# Altium schematic sheet BANK14.SchDoc: XC7A3G - BANK14
size A4; Date: 9 AUG 2026; Engineer: Parsa Malekpour; Revision: 1.0.0; SheetNumber: 2; SheetTotal: 18
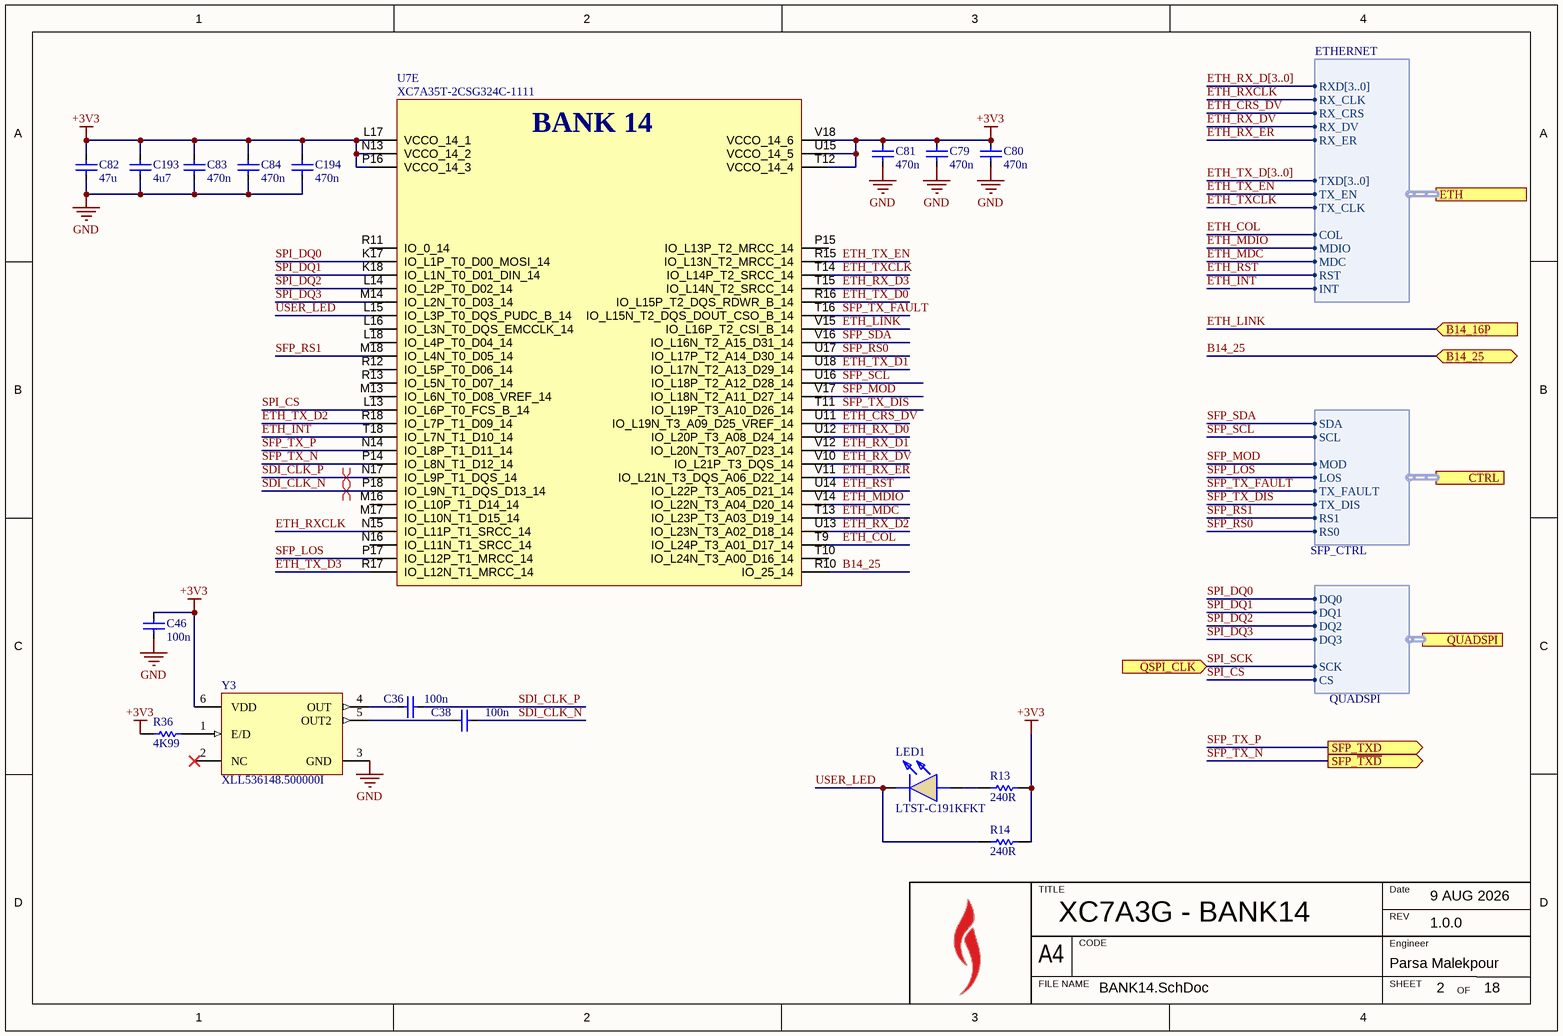
[diagram p0: BANK14.SchDoc]

## Parts
C36  value 100n  [FP-C1005-050-0_05-IPC_C]  (hidden comment: C1005X7R1H104K050BB)
C38  value 100n  [FP-C1005-050-0_05-IPC_C]  (hidden comment: C1005X7R1H104K050BB)
C46  value 100n  [FP-C1005-050-0_05-IPC_C]  (hidden comment: C1005X7R1H104K050BB)
C79  value 470n  [FP-C1005-050-0_05-IPC_C]  (hidden comment: C1005X5R1E474K050BB)
C80  value 470n  [FP-C1005-050-0_05-IPC_C]  (hidden comment: C1005X5R1E474K050BB)
C81  value 470n  [FP-C1005-050-0_05-IPC_C]  (hidden comment: C1005X5R1E474K050BB)
C82  value 47u  [FP-C2012-125-0_2-IPC_C]  (hidden comment: C2012X5R1A476M125AC)
C83  value 470n  [FP-C1005-050-0_05-IPC_C]  (hidden comment: C1005X5R1E474K050BB)
C84  value 470n  [FP-C1005-050-0_05-IPC_C]  (hidden comment: C1005X5R1E474K050BB)
C193  value 4u7  [FP-C1005-050-0_20-0_10-IPC_C]  (hidden comment: C1005X5R1A475K050BE)
C194  value 470n  [FP-C1005-050-0_05-IPC_C]  (hidden comment: C1005X5R1E474K050BB)
LED1  LTST-C191KFKT  [LEDC1608X55N]
R13  value 240R  [RESC1005X40X25LL05T10]  (hidden comment: RC0402FR-07240RL)
R14  value 240R  [RESC1005X40X25LL05T10]  (hidden comment: RC0402FR-07240RL)
R36  value 4K99  [RESC1005X40X25LL05T10]  (hidden comment: RC0402FR-074K99L)
U7  XC7A35T-2CSG324C-1111  [BGA324C80P18X18_1500X1500X150]  (part E of 8)
Y3  XLL536148.500000I  [JS6_MFG]

## Ports
B14_16P (in, see TOP[1B]), B14_25 (bidir, see TOP[1B]), CTRL (harness SFP_CTRL, see TOP[2B], OPTICS[1B]), ETH (harness ETHERNET, see TOP[1C]), QSPI_CLK (in, see TOP[2C]), QUADSPI (harness QUADSPI, see TOP[1C], FLASH[3B]), SFP_TXD (out, see TOP[2B]), SFP_~{TXD} (out, see TOP[2B])

## Harnesses
ETHERNET: RXD[3..0], TXD[3..0], TX_EN, TX_CLK, RX_CLK, RX_CRS, RX_DV, COL, RX_ER, MDIO, MDC, RST, INT
QUADSPI: DQ0, DQ1, DQ2, DQ3, SCK, CS
SFP_CTRL: RS0, RS1, TX_DIS, TX_FAULT, LOS, MOD, SCL, SDA

## Nets
+3V3: C46.2 C79.1 C80.1 C81.1 C82.1 C83.1 C84.1 C193.1 C194.1 R13.2 R14.2 R36.1 U7.L17(VCCO_14_1) U7.N13(VCCO_14_2) U7.P16(VCCO_14_3) U7.T12(VCCO_14_4) U7.U15(VCCO_14_5) U7.V18(VCCO_14_6) Y3.6(VDD)
GND: C46.1 C79.2 C80.2 C81.2 C82.2 C83.2 C84.2 C193.2 C194.2 Y3.3(GND)
B14_25: U7.R10(IO_25_14) ; port B14_25
ETH_COL: U7.T9(IO_L24P_T3_A01_D17_14) ; port ETH.COL
ETH_CRS_DV: U7.U11(IO_L19N_T3_A09_D25_VREF_14) ; port ETH.RX_CRS
ETH_INT: U7.T18(IO_L7N_T1_D10_14) ; port ETH.INT
ETH_LINK: U7.V15(IO_L16P_T2_CSI_B_14) ; port B14_16P
ETH_MDC: U7.T13(IO_L23P_T3_A03_D19_14) ; port ETH.MDC
ETH_MDIO: U7.V14(IO_L22N_T3_A04_D20_14) ; port ETH.MDIO
ETH_RST: U7.U14(IO_L22P_T3_A05_D21_14) ; port ETH.RST
ETH_RX_D0: U7.U12(IO_L20P_T3_A08_D24_14)
ETH_RX_D1: U7.V12(IO_L20N_T3_A07_D23_14)
ETH_RX_D2: U7.U13(IO_L23N_T3_A02_D18_14)
ETH_RX_D3: U7.T15(IO_L14N_T2_SRCC_14)
ETH_RX_DV: U7.V10(IO_L21P_T3_DQS_14) ; port ETH.RX_DV
ETH_RX_ER: U7.V11(IO_L21N_T3_DQS_A06_D22_14) ; port ETH.RX_ER
ETH_RXCLK: U7.N15(IO_L11P_T1_SRCC_14) ; port ETH.RX_CLK
ETH_TX_D0: U7.R16(IO_L15P_T2_DQS_RDWR_B_14)
ETH_TX_D1: U7.U18(IO_L17N_T2_A13_D29_14)
ETH_TX_D2: U7.R18(IO_L7P_T1_D09_14)
ETH_TX_D3: U7.R17(IO_L12N_T1_MRCC_14)
ETH_TX_EN: U7.R15(IO_L13N_T2_MRCC_14) ; port ETH.TX_EN
ETH_TXCLK: U7.T14(IO_L14P_T2_SRCC_14) ; port ETH.TX_CLK
SDI_CLK_N: C38.2 U7.P18(IO_L9N_T1_DQS_D13_14)
SDI_CLK_P: C36.2 U7.N17(IO_L9P_T1_DQS_14)
SFP_LOS: U7.P17(IO_L12P_T1_MRCC_14) ; port CTRL.LOS
SFP_MOD: U7.V17(IO_L18N_T2_A11_D27_14) ; port CTRL.MOD
SFP_RS0: U7.U17(IO_L17P_T2_A14_D30_14) ; port CTRL.RS0
SFP_RS1: U7.M18(IO_L4N_T0_D05_14) ; port CTRL.RS1
SFP_SCL: U7.U16(IO_L18P_T2_A12_D28_14) ; port CTRL.SCL
SFP_SDA: U7.V16(IO_L16N_T2_A15_D31_14) ; port CTRL.SDA
SFP_TX_DIS: U7.T11(IO_L19P_T3_A10_D26_14) ; port CTRL.TX_DIS
SFP_TX_FAULT: U7.T16(IO_L15N_T2_DQS_DOUT_CSO_B_14) ; port CTRL.TX_FAULT
SFP_TX_N: U7.P14(IO_L8N_T1_D12_14) ; port SFP_~{TXD}
SFP_TX_P: U7.N14(IO_L8P_T1_D11_14) ; port SFP_TXD
SPI_CS: U7.L13(IO_L6P_T0_FCS_B_14) ; port QUADSPI.CS
SPI_DQ0: U7.K17(IO_L1P_T0_D00_MOSI_14) ; port QUADSPI.DQ0
SPI_DQ1: U7.K18(IO_L1N_T0_D01_DIN_14) ; port QUADSPI.DQ1
SPI_DQ2: U7.L14(IO_L2P_T0_D02_14) ; port QUADSPI.DQ2
SPI_DQ3: U7.M14(IO_L2N_T0_D03_14) ; port QUADSPI.DQ3
SPI_SCK: port QSPI_CLK, port QUADSPI.SCK
USER_LED: LED1.1(K) R14.1 U7.L15(IO_L3P_T0_DQS_PUDC_B_14)
NetC36_1: C36.1 Y3.4(OUT)
NetC38_1: C38.1 Y3.5(OUT2)
NetLED1_2: LED1.2(A) R13.1
NetR36_2: R36.2 Y3.1(E/D)

Not connected (* = marked no-connect by the designer): U7 L16(IO_L3N_T0_DQS_EMCCLK_14) L18(IO_L4P_T0_D04_14) M13(IO_L6N_T0_D08_VREF_14) M16(IO_L10P_T1_D14_14) M17(IO_L10N_T1_D15_14) N16(IO_L11N_T1_SRCC_14) P15(IO_L13P_T2_MRCC_14) R11(IO_0_14) R12(IO_L5P_T0_D06_14) R13(IO_L5N_T0_D07_14) T10(IO_L24N_T3_A00_D16_14); Y3 2(NC)*

## Buses and harness runs
bus ETH_RX_D[3..0]
bus ETH_TX_D[3..0]

## Layout directives
differential pair: SDI_CLK_N, SDI_CLK_P

## Notes on the sheet
- TITLE
- REV
- Date
- A4
- FILE NAME
- CODE
- SHEET
- Engineer
- OF
- (in symbol XC7A35T-2CSG324C-1111, part E) BANK 14

## Library data of the parts
C36 C38 C46 = C1005X7R1H104K050BB: MLCC 100nF ±10% 50V X7R SMD 0402; Dielectric Material: Ceramic; Voltage: 50V; Min Operating Temperature: -55°C; Depth: 0.5mm; Radiation Hardening: No; RoHS Compliant: Yes; Voltage Rating (DC): 50V; Lead Free: Lead Free; Resistor Type: Ceramic; Height: 0.5mm; Dielectric: X7R; Thickness: 0.022inch; Case/Package: 0402; Case Code (Metric): 1005; Termination: SMD/SMT; Packaging: Tape and Reel; Max Operating Temperature: 125°C; Mount: Surface Mount; Package Quantity: 1; Width: 0.02inch; Weight: 2.3E-05oz; Voltage Rating: 50V; Tolerance: 10%; Construction: Flat; Case Code (Imperial): 0402; Length: 1mm; REACH SVHC: No SVHC; Series: C; Part Number: C1005X7R1H104K050BB
C79-C81 C83 C84 C194 = C1005X5R1E474K050BB: Multilayer Ceramic Capacitors 470nF ±10% 25V X5R SMD 0402; Dissipation Factor: 10%; Case Code (Metric): 1005; RoHS Compliant: Yes; Lead Free: Lead Free; Length: 1mm; Case/Package: 0402; Termination: SMD/SMT; Dielectric Material: Ceramic; Dielectric: X5R; Depth: 0.5mm; Series: C; Voltage: 25V; Tolerance: 10%; Packaging: Tape and Reel; Resistor Type: Ceramic; Min Operating Temperature: -55°C; Width: 0.02inch; Thickness: 500um; Package Quantity: 10000; Case Code (Imperial): 0402; Construction: Flat; Height: 0.5mm; REACH SVHC: No SVHC; Radiation Hardening: No; Weight: 2.3E-05oz; Mount: Surface Mount; Voltage Rating (DC): 25V; Max Operating Temperature: 85°C; Part Number: C1005X5R1E474K050BB; Voltage Rating: 25V
C82 = C2012X5R1A476M125AC: 47μF ±20% 10V X5R SMD 0805 Multilayer Ceramic Capacitors; RoHS Compliant: Yes; Dielectric: X5R; Case Code (Imperial): 0805; Min Operating Temperature: -55°C; Length: 2mm; Voltage Rating: 10V; Lead Free: Lead Free; Weight: 0.000194oz; Resistor Type: Ceramic; Dielectric Material: Ceramic; Max Operating Temperature: 85°C; Height: 1.25mm; Width: 0.049inch; Depth: 1.25mm; Termination: SMD/SMT; Case/Package: 0805; Voltage Rating (DC): 10V; Voltage: 10V; Thickness: 0.057inch; Tolerance: 20%; REACH SVHC: No SVHC; Package Quantity: 1; Series: C; Case Code (Metric): 2012; Mount: Surface Mount; Packaging: Tape and Reel; Part Number: C2012X5R1A476M125AC
C193 = C1005X5R1A475K050BE: 4.7UF 10V X5R 0402; Tolerance: 10%; Max Operating Temperature: 85°C; Case Code (Metric): 1005; Voltage Rating: 10V; Packaging: Tape and Reel; Case/Package: 0402; Features: Soft Termination; Min Operating Temperature: -55°C; Mount: Surface Mount; Case Code (Imperial): 0402; RoHS Compliant: Yes; Part Number: C1005X5R1A475K050BE
LED1 = LTST-C191KFKT: LED; Manufacturer: Lite-On; Value: Orange; Datasheet Link: https://datasheet.datasheetarchive.com/originals/distributors/Datasheets-305/79307.pdf; Height: 0.55mm; Mouser Part Number: 859-LTST-C191KFKT; Mouser Price/Stock: https://www.mouser.co.uk/ProductDetail/Lite-On/LTST-C191KFKT?qs=1bx9pL%2Fk%252BiAv01YAc0eitQ%3D%3D; Arrow Part Number: LTST-C191KFKT; Arrow Price/Stock: https://www.arrow.com/en/products/ltst-c191kfkt/lite-on-technology.html?utm_currency=USD&region=nac; Part Number: LTST-C191KFKT
R13 R14 = RC0402FR-07240RL: 240R 0.063W 1% 0402 (1005 Metric)  SMD; Case-Metric: 1005; Case-EIA: 0402; Power: 0.063 W; Tolerance: 1 %; Technology: SMT; Part Number: RC0402FR-07240RL; Parameter 1: *
R36 = RC0402FR-074K99L: Manufacturer: Yageo / Phycomp; Part Number: RC0402FR-074K99L
U7 = XC7A35T-2CSG324C-1111: Integrated Circuit; Manufacturer_Name: AMD; Datasheet Link: https://www.xilinx.com/support/documentation/data_sheets/ds181_Artix_7_Data_Sheet.pdf; Height: 1.5mm; Manufacturer_Part_Number: XC7A35T-2CSG324C; Mouser Part Number: 217-XC7A35T-2CSG324C; Mouser Price/Stock: https://www.mouser.co.uk/ProductDetail/AMD-Xilinx/XC7A35T-2CSG324C?qs=rrS6PyfT74fMA9%2F3WtPZmw%3D%3D
Y3 = XLL536148.500000I: Oscillator, 148.5Mhz, Lvds, 5Mm X 3.2Mm Rohs Compliant: Yes; Min Input Voltage: 3.135V; Max Output Frequency: 999.9MHz; Max Input Voltage: 3.465V; ComponentLink1Description: Manufacturer's Website; ComponentLink2Description: Datasheet URL; Mount: Surface Mount; Max Operating Temperature: 85°C; ComponentLink3Description: Manufacturer's Package Drawing; RoHS: Compliant; Number of Pins: 6; ComponentLink2URL: https://octopart.com/cad-content/api/get-model-datasheet/15189/107081581; Output Type: LVDS; Case/Package: CLCC; ComponentLink1URL: http://www.renesas.com; HelpURL: https://octopart.com/cad-content/api/get-model-datasheet/15189/107081581; Min Operating Temperature: -40°C; ComponentLink3URL: https://www.renesas.com/en/document/psc/js6-package-outline-50-x-32-mm-body-11-mm-thick; Height: 1.2mm